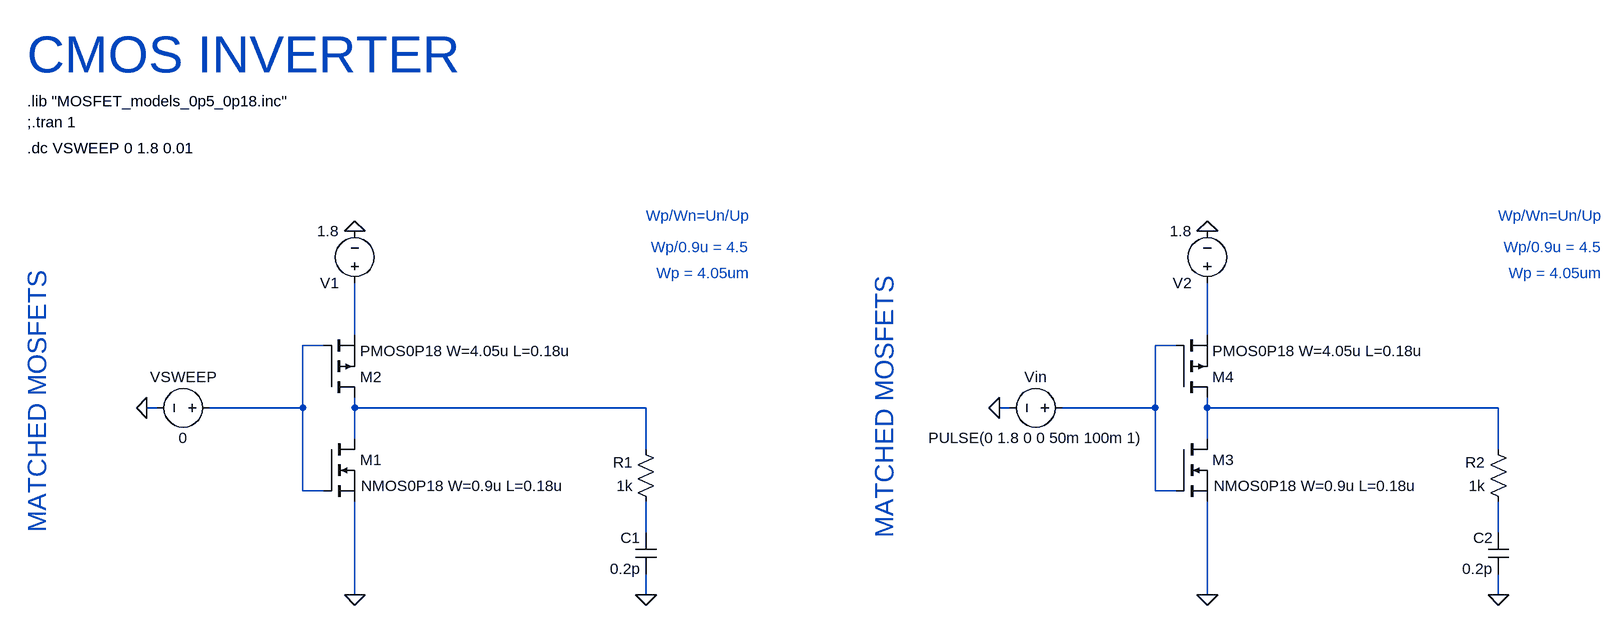
[diagram p0: schematic CMOS_INV_Matched_0_18u.asc]
CMOS_INV_Matched_0_18u.asc, the LTspice schematic file:
Version 4
SHEET 1 1700 1640
WIRE -880 -224 -880 -304
WIRE 432 -224 432 -304
WIRE -928 -208 -960 -208
WIRE 384 -208 352 -208
WIRE -1184 -112 -1200 -112
WIRE -960 -112 -960 -208
WIRE -960 -112 -1104 -112
WIRE -880 -112 -880 -128
WIRE -432 -112 -880 -112
WIRE 128 -112 112 -112
WIRE 352 -112 352 -208
WIRE 352 -112 208 -112
WIRE 432 -112 432 -128
WIRE 880 -112 432 -112
WIRE -880 -64 -880 -112
WIRE 432 -64 432 -112
WIRE -432 -48 -432 -112
WIRE 880 -48 880 -112
WIRE -960 16 -960 -112
WIRE -928 16 -960 16
WIRE 352 16 352 -112
WIRE 384 16 352 16
WIRE -432 80 -432 32
WIRE 880 80 880 32
WIRE -880 176 -880 32
WIRE -432 176 -432 144
WIRE 432 176 432 32
WIRE 880 176 880 144
FLAG -880 176 0
FLAG -880 -384 0
FLAG -1200 -112 0
FLAG -432 176 0
FLAG 432 176 0
FLAG 432 -384 0
FLAG 112 -112 0
FLAG 880 176 0
SYMBOL nmos -928 -64 R0
WINDOW 3 58 72 Left 2
SYMATTR Value NMOS0P18 W=0.9u L=0.18u
SYMATTR InstName M1
SYMBOL pmos -928 -128 M180
SYMATTR InstName M2
SYMATTR Value PMOS0P18 W=4.05u L=0.18u
SYMBOL voltage -880 -288 R180
WINDOW 123 0 0 Left 0
WINDOW 39 0 0 Left 0
SYMATTR InstName V1
SYMATTR Value 1.8
SYMBOL voltage -1088 -112 R90
WINDOW 0 -32 56 VBottom 2
WINDOW 3 62 56 VBottom 2
WINDOW 123 0 0 Left 0
WINDOW 39 0 0 Left 0
SYMATTR InstName VSWEEP
SYMATTR Value 0
SYMBOL res -416 48 R180
WINDOW 0 36 76 Left 2
WINDOW 3 36 40 Left 2
SYMATTR InstName R1
SYMATTR Value 1k
SYMBOL cap -416 144 R180
WINDOW 0 24 56 Left 2
WINDOW 3 24 8 Left 2
SYMATTR InstName C1
SYMATTR Value 0.2p
SYMBOL nmos 384 -64 R0
WINDOW 3 58 72 Left 2
SYMATTR Value NMOS0P18 W=0.9u L=0.18u
SYMATTR InstName M3
SYMBOL pmos 384 -128 M180
SYMATTR InstName M4
SYMATTR Value PMOS0P18 W=4.05u L=0.18u
SYMBOL voltage 432 -288 R180
WINDOW 123 0 0 Left 0
WINDOW 39 0 0 Left 0
SYMATTR InstName V2
SYMATTR Value 1.8
SYMBOL voltage 224 -112 R90
WINDOW 0 -32 56 VBottom 2
WINDOW 3 62 56 VBottom 2
WINDOW 123 0 0 Left 0
WINDOW 39 0 0 Left 0
SYMATTR InstName Vin
SYMATTR Value PULSE(0 1.8 0 0 50m 100m 1)
SYMBOL res 896 48 R180
WINDOW 0 36 76 Left 2
WINDOW 3 36 40 Left 2
SYMATTR InstName R2
SYMATTR Value 1k
SYMBOL cap 896 144 R180
WINDOW 0 24 56 Left 2
WINDOW 3 24 8 Left 2
SYMATTR InstName C2
SYMATTR Value 0.2p
TEXT -1384 -584 Left 2 !.lib "MOSFET_models_0p5_0p18.inc"
TEXT -1384 -552 Left 2 !;.tran 1
TEXT -1384 -512 Left 2 !.dc VSWEEP 0 1.8 0.01
TEXT -1368 80 VLeft 4 ;MATCHED MOSFETS
TEXT -1384 -656 Left 6 ;CMOS INVERTER
TEXT -432 -408 Left 2 ;Wp/Wn=Un/Up
TEXT -424 -360 Left 2 ;Wp/0.9u = 4.5
TEXT -416 -320 Left 2 ;Wp = 4.05um
TEXT 880 -408 Left 2 ;Wp/Wn=Un/Up
TEXT 888 -360 Left 2 ;Wp/0.9u = 4.5
TEXT 896 -320 Left 2 ;Wp = 4.05um
TEXT -64 88 VLeft 4 ;MATCHED MOSFETS

The netlist it stands for:
* CMOS_INV_Matched_0_18u.asc
M1 N005 N003 0 0 NMOS0P18 W=0.9u L=0.18u
M2 N005 N003 N001 N001 PMOS0P18 W=4.05u L=0.18u
V1 N001 0 1.8
VSWEEP N003 0 0
R1 N007 N005 1k
C1 0 N007 0.2p
M3 N006 N004 0 0 NMOS0P18 W=0.9u L=0.18u
M4 N006 N004 N002 N002 PMOS0P18 W=4.05u L=0.18u
V2 N002 0 1.8
Vin N004 0 PULSE(0 1.8 0 0 50m 100m 1)
R2 N008 N006 1k
C2 0 N008 0.2p
.model NMOS NMOS
.model PMOS PMOS
.lib standard.mos
.lib "MOSFET_models_0p5_0p18.inc"
;.tran 1
.dc VSWEEP 0 1.8 0.01
* MATCHED MOSFETS
* CMOS INVERTER
* Wp/Wn=Un/Up
* Wp/0.9u = 4.5
* Wp = 4.05um
* Wp/Wn=Un/Up
* Wp/0.9u = 4.5
* Wp = 4.05um
* MATCHED MOSFETS
.backanno
.end